# Altium schematic sheet Schematic.SchDoc (part 2 of 3)
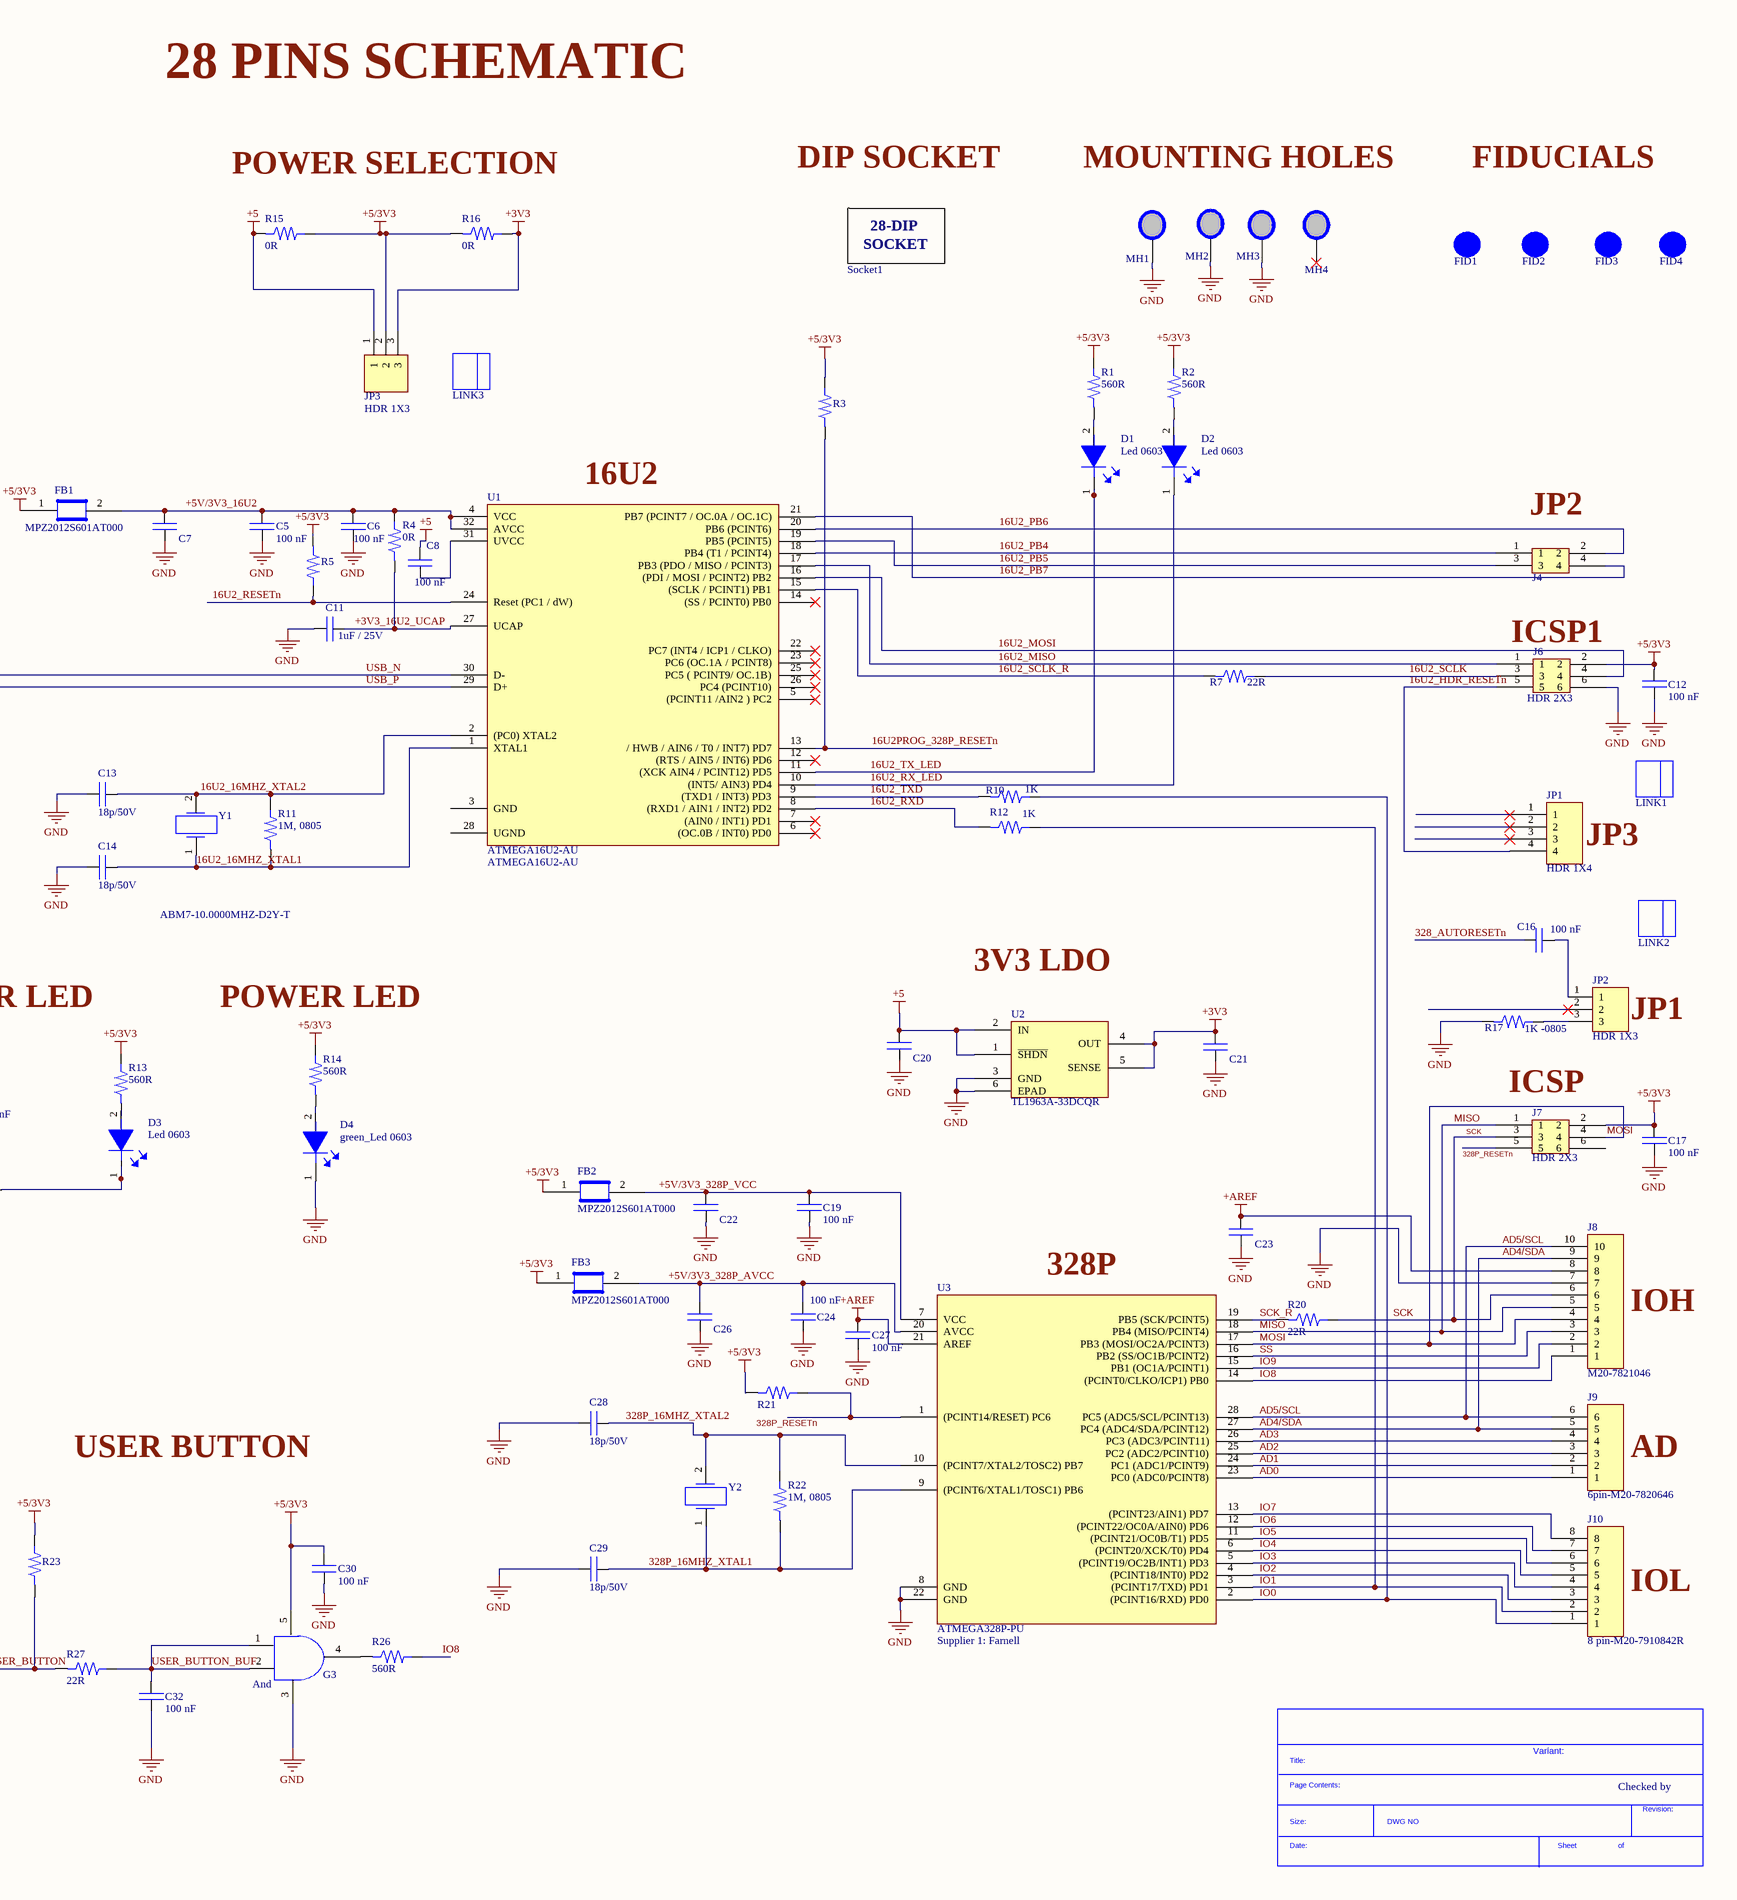
[diagram p2: Schematic.SchDoc, right]
## Library data of the parts
C1-C6 C8 C12 C15-C19 C24 C25 C27 C30-C33 = C2012X7R1H104K125AE: Cap Ceramic 0.1uF 50V X7R 10% SMD 0805 125°C Blister Plastic T/R; Manufacturer: TDK; Capacitance: 100nF; Supplier 1: Arrow Electronics; Supplier Part Number 1: C2012X7R1H104K125AE; Manufacturer Part Number: C2012X7R1H104K125AE; RoHS: Yes; Category: Ceramic Capacitors; Stock 1: 1940; Pricing 1: 1=0,23420, 10=0,11270, 25=0,11160, 50=0,10890, 100=0,09210, 250=0,09120, 500=0,06310, 1000=0,05490 (USD); Mount: Surface Mount; Case/Package: 0805; Case Code (Metric): 2012; Case Code (Imperial): 0805; Weight: 0.000194oz; Min Operating Temperature: -55°C; Max Operating Temperature: 125°C; Package Quantity: 2000; Packaging: Tape and Reel; Tolerance: 10%; Voltage Rating: 50V; Dielectric: X7R; Termination: SMD/SMT; Voltage Rating (DC): 50V; Features: Soft Termination; Length: 0.079inch; Width: 0.049inch; Height: 1.25mm; Thickness: 0.057inch; RoHS Compliant: Yes; ComponentLink1URL: https://datasheet.ciiva.com/29534/mlcc-commercial-soft-en-29534235.pdf?src-supplier=Digi-Key; ComponentLink1Description: https://datasheet.ciiva.com/29534/mlcc-commercial-soft-en-29534235.pdf?src-supplier=Digi-Key
C7 C20-C23 C26 = C2012X5R1C106M085AC: TDK - C2012X5R1C106M085AC - SMD Multilayer Ceramic Capacitor, 10 µF, 16 V, 0805 [2012 Metric], ± 20%, X5R, C Series TDK; Capacitance: 10uF; Supplier 1: Farnell; Supplier Part Number 1: 2522051; Manufacturer: TDK; Manufacturer Part Number: C2012X5R1C106M085AC; RoHS: Yes; Category: Ceramic Capacitors; Stock 1: 28000; Pricing 1: 4000=0,03440, 20000=0,03390, 40000=0,03330 (EUR); Mount: Surface Mount; Case/Package: 0805; Number of Pins: 2; Case Code (Metric): 2012; Case Code (Imperial): 0805; Weight: 0.000194oz; Dielectric Material: Ceramic; Min Operating Temperature: -55°C; Max Operating Temperature: 85°C; Packaging: Tape and Reel; Voltage Rating: 16V; Tolerance: 20%; Termination: SMD/SMT; Package Quantity: 4000; Voltage Rating (DC): 16V; Dielectric: X5R; Resistor Type: Ceramic; Series: C; Construction: Flat; Voltage: 16V; Length: 2mm; Width: 1.25mm; Height: 0.85mm; Thickness: 0.037inch; Depth: 1.25mm; RoHS Compliant: Yes; Lead Free: Lead Free; ComponentLink1URL: https://datasheet.ciiva.com/24218/c2012x5r1c106m085ac-265002-24218340.pdf?src-supplier=Mouser; ComponentLink1Description: https://datasheet.ciiva.com/24218/c2012x5r1c106m085ac-265002-24218340.pdf?src-supplier=Mouser; ComponentLink2URL: https://datasheet.ciiva.com/11788/0900766b80c1bb00-11788108.pdf?src-supplier=RSComponents; ComponentLink2Description: https://datasheet.ciiva.com/11788/0900766b80c1bb00-11788108.pdf?src-supplier=RSComponents; ComponentLink3URL: https://datasheet.ciiva.com/6290/tdkmlcccaprange-6290485.pdf?src-supplier=Digi-Key; ComponentLink3Description: https://datasheet.ciiva.com/6290/tdkmlcccaprange-6290485.pdf?src-supplier=Digi-Key; ComponentLink4URL: https://datasheet.ciiva.com/22725/1913358-22725557.pdf?src-supplier=Element14; ComponentLink4Description: https://datasheet.ciiva.com/22725/1913358-22725557.pdf?src-supplier=Element14; ComponentLink5URL: https://datasheet.ciiva.com/6290/tdkmlcccaprange-6290487.pdf?src-supplier=Digi-Key; ComponentLink5Description: https://datasheet.ciiva.com/6290/tdkmlcccaprange-6290487.pdf?src-supplier=Digi-Key; ComponentLink6URL: https://datasheet.ciiva.com/16449/e412-c-16449591.pdf?src-supplier=Future+Electronics; ComponentLink6Description: https://datasheet.ciiva.com/16449/e412-c-16449591.pdf?src-supplier=Future+Electronics; ComponentLink7URL: https://datasheet.ciiva.com/23803/1796654-23803021.pdf?src-supplier=Newark; ComponentLink7Description: https://datasheet.ciiva.com/23803/1796654-23803021.pdf?src-supplier=Newark
C9 C10 = EEE-1AA101WR: CAP ALUM 100UF 20% 10V SMD; Manufacturer: Panasonic; Ripple Current: 50mA; Life (Hours): 1000Hour; Supplier 1: Rs; Supplier Part Number 1: 1763738; Manufacturer Part Number: EEE-1AA101WR; RoHS: Yes; Category: Aluminum Electrolytic Capacitors; Stock 1: 1; Mount: Surface Mount,PCB; Case/Package: Radial; Contact Plating: Tin; Min Operating Temperature: -40°C; Max Operating Temperature: 85°C; Capacitance: 100uF; Voltage Rating: 10V; Tolerance: 20%; Packaging: Tape and Reel; Package Quantity: 1000; Voltage Rating (DC): 10V; Termination: SMD/SMT; Ripple Current (AC): 50mA; Series: S; Construction: Cylindrical; Diameter: 5mm; Length: 5.5mm; Height: 5.4mm; Height - Seated (Max): 0.213inch; Ratings: AEC-Q200; Radiation Hardening: No; Lead Free: Lead Free; RoHS Compliant: Yes; ComponentLink1URL: https://datasheet.ciiva.com/26945/getdatasheetpartid-169213-26945071.pdf?src-supplier=Verical; ComponentLink1Description: https://datasheet.ciiva.com/26945/getdatasheetpartid-169213-26945071.pdf?src-supplier=Verical; ComponentLink2URL: https://datasheet.ciiva.com/24027/aba0000ce2-40801-24027541.pdf?src-supplier=Mouser; ComponentLink2Description: https://datasheet.ciiva.com/24027/aba0000ce2-40801-24027541.pdf?src-supplier=Mouser; ComponentLink3URL: https://datasheet.ciiva.com/14598/70255710-14598233.pdf?src-supplier=Allied+Electronics; ComponentLink3Description: https://datasheet.ciiva.com/14598/70255710-14598233.pdf?src-supplier=Allied+Electronics; ComponentLink4URL: https://datasheet.ciiva.com/14605/70255710-14605689.pdf?src-supplier=Allied+Electronics; ComponentLink4Description: https://datasheet.ciiva.com/14605/70255710-14605689.pdf?src-supplier=Allied+Electronics; ComponentLink5URL: https://datasheet.ciiva.com/11673/aba0000ce2-11673882.pdf?src-supplier=Avnet; ComponentLink5Description: https://datasheet.ciiva.com/11673/aba0000ce2-11673882.pdf?src-supplier=Avnet; ComponentLink6URL: https://datasheet.ciiva.com/16427/aba0000ce2-16427544.pdf?src-supplier=Future+Electronics; ComponentLink6Description: https://datasheet.ciiva.com/16427/aba0000ce2-16427544.pdf?src-supplier=Future+Electronics; ComponentLink7URL: https://datasheet.ciiva.com/2983/aba0000ce2-2983906.pdf?src-supplier=Avnet; ComponentLink7Description: https://datasheet.ciiva.com/2983/aba0000ce2-2983906.pdf?src-supplier=Avnet; ComponentLink8URL: https://datasheet.ciiva.com/30075/11aba0000ce2-30075303.pdf?src-supplier=Onlinecomponents.com; ComponentLink8Description: https://datasheet.ciiva.com/30075/11aba0000ce2-30075303.pdf?src-supplier=Onlinecomponents.com
C11 = C2012X5R1E105K125AA: CAP CER 1UF 25V X5R 0805; Manufacturer: TDK; Dielectric Material: Ceramic; Tolerance: 10%; Supplier 1: Farnell; Supplier Part Number 1: 2525136; Manufacturer Part Number: C2012X5R1E105K125AA; RoHS: Yes; Category: Ceramic Capacitors; Stock 1: 864; Pricing 1: 5=0,09500, 50=0,08100, 250=0,06800, 500=0,05500, 1000=0,04900 (EUR); Mount: Surface Mount; Case/Package: 0805; Number of Pins: 2; Case Code (Metric): 2012; Case Code (Imperial): 0805; Weight: 0.000194oz; Min Operating Temperature: -55°C; Max Operating Temperature: 85°C; Capacitance: 1uF; Voltage Rating: 25V; Packaging: Tape and Reel; Voltage Rating (DC): 25V; Dielectric: X5R; Termination: SMD/SMT; Construction: Flat; Package Quantity: 2000; Resistor Type: Ceramic; Voltage: 25V; Series: C; Length: 2mm; Width: 0.049inch; Height: 1.25mm; Depth: 1.25mm; Thickness: 0.057inch; Radiation Hardening: No; Lead Free: Lead Free; RoHS Compliant: Yes; Reach SVHC Compliant: Yes; ComponentLink1URL: https://datasheet.ciiva.com/11787/0900766b80c1bb00-11787608.pdf?src-supplier=Rs; ComponentLink1Description: https://datasheet.ciiva.com/11787/0900766b80c1bb00-11787608.pdf?src-supplier=Rs; ComponentLink2URL: https://datasheet.ciiva.com/16449/e412-c-16449595.pdf?src-supplier=Future+Electronics; ComponentLink2Description: https://datasheet.ciiva.com/16449/e412-c-16449595.pdf?src-supplier=Future+Electronics; ComponentLink3URL: https://datasheet.ciiva.com/28602/1744655-28602171.pdf?src-supplier=Element14; ComponentLink3Description: https://datasheet.ciiva.com/28602/1744655-28602171.pdf?src-supplier=Element14; ComponentLink4URL: https://datasheet.ciiva.com/15192/getdatasheetpartid-726707-15192140.pdf?src-supplier=Verical; ComponentLink4Description: https://datasheet.ciiva.com/15192/getdatasheetpartid-726707-15192140.pdf?src-supplier=Verical
C13 C14 C28 C29 = C0805C180G5GAC7800: Cap Ceramic 18pF 50V C0G 2% SMD 0805 125°C Paper T/R; Manufacturer: KEMET; Supplier 1: Digi-Key; Supplier Part Number 1: 399-17433-1-ND; Manufacturer Part Number: C0805C180G5GAC7800; RoHS: Yes; Category: Ceramic Capacitors; Stock 1: 2700; Pricing 1: 1=0,51000, 10=0,36200, 50=0,27400, 100=0,23860, 500=0,17676, 1000=0,15024 (USD); Case/Package: 0805; Dielectric Material: Ceramic; Min Operating Temperature: -55°C; Max Operating Temperature: 125°C; Capacitance: 18pF; Tolerance: 2%; Packaging: Tape and Reel; Dielectric: C0G; Voltage Rating (DC): 50V; Length: 2mm; Depth: 1.25mm; Lead Free: Lead Free; RoHS Compliant: Yes
D1-D3 = LY L296-Q2R2-26-Z: LED Uni-Color Yellow 591nm 2-Pin Chip 0603(1608Metric) T/R; Manufacturer: Osram Opto; Lens Color: White; Luminous Intensity: 180mcd; Forward Current: 30mA; Viewing Angle: 160°; Forward Voltage: 2V; Lens Style: Flat,Rectangular,Diffused,Colorless; Test Current: 20mA; Dominant Wavelength: 587nm; Luminous Flux: 0.5lm; Number of Elements: 1; Power Dissipation: 80mW; Reverse Voltage: 12V; Lens Transparency: Diffused; Lens Size: 0.8mm; Supplier 1: Arrow Electronics; Supplier Part Number 1: LY L296-Q2R2-26-Z; Manufacturer Part Number: LY L296-Q2R2-26-Z; RoHS: Yes; Category: LEDs; Stock 1: 4966; Pricing 1: 1=0,40180, 10=0,24700, 25=0,24210, 100=0,14180, 250=0,13540, 500=0,12360, 1000=0,10280, 3000=0,09810 (USD); Mount: Surface Mount; Case/Package: 0603; Number of Pins: 2; Color: Yellow; Case Code (Imperial): 0603; Case Code (Metric): 1608; Min Operating Temperature: -40°C; Max Operating Temperature: 100°C; Packaging: Tape and Reel; Number of LEDs: 1; Illumination Color: Yellow; Package Quantity: 5000; Series: SMARTLED® 0603; Wavelength: 591nm; Length: 1.7mm; Width: 0.8mm; Depth: 0.8mm; Radiation Hardening: No; Reach SVHC Compliant: Yes; ComponentLink1URL: https://datasheet.ciiva.com/8060/30055-8060144.pdf?src-supplier=Element14; ComponentLink1Description: https://datasheet.ciiva.com/8060/30055-8060144.pdf?src-supplier=Element14
D4 = LY L296-Q2R2-26-Z_1: LED Uni-Color Yellow 591nm 2-Pin Chip 0603(1608Metric) T/R; Manufacturer: Osram Opto; Lens Color: White; Luminous Intensity: 180mcd; Forward Current: 30mA; Viewing Angle: 160°; Forward Voltage: 2V; Lens Style: Flat,Rectangular,Diffused,Colorless; Test Current: 20mA; Dominant Wavelength: 587nm; Luminous Flux: 0.5lm; Number of Elements: 1; Power Dissipation: 80mW; Reverse Voltage: 12V; Lens Transparency: Diffused; Lens Size: 0.8mm; Supplier 1: Arrow Electronics; Supplier Part Number 1: LY L296-Q2R2-26-Z; Manufacturer Part Number: LY L296-Q2R2-26-Z; RoHS: Yes; Category: LEDs; Stock 1: 4966; Pricing 1: 1=0,40180, 10=0,24700, 25=0,24210, 100=0,14180, 250=0,13540, 500=0,12360, 1000=0,10280, 3000=0,09810 (USD); Mount: Surface Mount; Case/Package: 0603; Number of Pins: 2; Color: Yellow; Case Code (Imperial): 0603; Case Code (Metric): 1608; Min Operating Temperature: -40°C; Max Operating Temperature: 100°C; Packaging: Tape and Reel; Number of LEDs: 1; Illumination Color: Yellow; Package Quantity: 5000; Series: SMARTLED® 0603; Wavelength: 591nm; Length: 1.7mm; Width: 0.8mm; Depth: 0.8mm; Radiation Hardening: No; Reach SVHC Compliant: Yes; ComponentLink1URL: https://datasheet.ciiva.com/8060/30055-8060144.pdf?src-supplier=Element14; ComponentLink1Description: https://datasheet.ciiva.com/8060/30055-8060144.pdf?src-supplier=Element14
D5 D6 = Schottky-BAT54HT1G: VR=30V IF=200mA 10pF P=200mW; Manufacturer: ON Semiconductor / Fairchild; Forward Voltage: 800mV; Forward Current: 200mA; Recovery Time: 5ns; Max Repetitive Reverse Voltage (Vrrm): 30V; Peak Non-Repetitive Surge Current: 600mA; Element Configuration: Single; Max Reverse Current: 2uA; Power Dissipation: 200mW; Polarity: Standard; Supplier 1: Farnell; Supplier Part Number 1: 1459033; Manufacturer Part Number: BAT54HT1G; RoHS: Yes; Category: Schottky Diodes; Stock 1: 99653; Pricing 1: 5=0,26400, 10=0,21900, 100=0,11700, 500=0,07700 (EUR); Mount: Surface Mount; Number of Pins: 2; Contact Plating: Tin,Matte; Min Operating Temperature: -55°C; Max Operating Temperature: 150°C; Packaging: Tape and Reel; Package Quantity: 1; Average Rectified Current: 200mA; Reverse Recovery Time: 5ns; Max Forward Surge Current (Ifsm): 600mA; Max Reverse Voltage (DC): 30V; Series: -; Max Surge Current: 600mA; Voltage Rating (DC): 30V; Current Rating: 200mA; Capacitance: 10pF; Output Current: 200mA; Reverse Voltage: 30V; Max Reverse Leakage Current: 2uA; Reverse Recovery Time-Max: 5ns; Length: 1.8mm; Width: 1.35mm; Height: 1mm; Radiation Hardening: No; Lead Free: Lead Free; RoHS Compliant: Yes; Reach SVHC Compliant: Yes; ComponentLink1URL: https://datasheet.ciiva.com/4714/bat54ht1-d-72881-4714706.pdf?src-supplier=Mouser; ComponentLink1Description: https://datasheet.ciiva.com/4714/bat54ht1-d-72881-4714706.pdf?src-supplier=Mouser; ComponentLink2URL: https://datasheet.ciiva.com/4452/bat54ht1g-104602-4452889.pdf?src-supplier=Mouser; ComponentLink2Description: https://datasheet.ciiva.com/4452/bat54ht1g-104602-4452889.pdf?src-supplier=Mouser; ComponentLink3URL: https://datasheet.ciiva.com/30479/0900766b811a63a9-30479442.pdf?src-supplier=RSComponents; ComponentLink3Description: https://datasheet.ciiva.com/30479/0900766b811a63a9-30479442.pdf?src-supplier=RSComponents; ComponentLink4URL: https://datasheet.ciiva.com/34301/806549-34301562.pdf?src-supplier=Jameco; ComponentLink4Description: https://datasheet.ciiva.com/34301/806549-34301562.pdf?src-supplier=Jameco; ComponentLink5URL: https://datasheet.ciiva.com/1240/1747983-1240762.pdf?src-supplier=Newark; ComponentLink5Description: https://datasheet.ciiva.com/1240/1747983-1240762.pdf?src-supplier=Newark; ComponentLink6URL: https://datasheet.ciiva.com/915/bat54ht1-d-915445.pdf?src-supplier=Digi-Key; ComponentLink6Description: https://datasheet.ciiva.com/915/bat54ht1-d-915445.pdf?src-supplier=Digi-Key; ComponentLink7URL: https://datasheet.ciiva.com/915/bat54ht1-d-915444.pdf?src-supplier=Digi-Key; ComponentLink7Description: https://datasheet.ciiva.com/915/bat54ht1-d-915444.pdf?src-supplier=Digi-Key; ComponentLink8URL: https://datasheet.ciiva.com/910/bat54ht1g-910499.pdf?src-supplier=Digi-Key; ComponentLink8Description: https://datasheet.ciiva.com/910/bat54ht1g-910499.pdf?src-supplier=Digi-Key; ComponentLink9URL: https://datasheet.ciiva.com/910/bat54ht1g-910498.pdf?src-supplier=Digi-Key; ComponentLink9Description: https://datasheet.ciiva.com/910/bat54ht1g-910498.pdf?src-supplier=Digi-Key; ComponentLink10URL: https://datasheet.ciiva.com/8294/bat54ht1-d-8294645.pdf?src-supplier=Avnet; ComponentLink10Description: https://datasheet.ciiva.com/8294/bat54ht1-d-8294645.pdf?src-supplier=Avnet; ComponentLink11URL: https://datasheet.ciiva.com/910/bat54ht1g-910497.pdf?src-supplier=Digi-Key; ComponentLink11Description: https://datasheet.ciiva.com/910/bat54ht1g-910497.pdf?src-supplier=Digi-Key; ComponentLink12URL: https://datasheet.ciiva.com/8303/bat54ht1g-8303645.pdf?src-supplier=Avnet; ComponentLink12Description: https://datasheet.ciiva.com/8303/bat54ht1g-8303645.pdf?src-supplier=Avnet; ComponentLink13URL: https://datasheet.ciiva.com/915/bat54ht1-d-915443.pdf?src-supplier=Digi-Key; ComponentLink13Description: https://datasheet.ciiva.com/915/bat54ht1-d-915443.pdf?src-supplier=Digi-Key; ComponentLink14URL: https://datasheet.ciiva.com/46429/1727620-46429206.pdf?src-supplier=Element14; ComponentLink14Description: https://datasheet.ciiva.com/46429/1727620-46429206.pdf?src-supplier=Element14; ComponentLink15URL: https://datasheet.ciiva.com/1180/bat54ht1-d-1180252.pdf?src-supplier=Element14; ComponentLink15Description: https://datasheet.ciiva.com/1180/bat54ht1-d-1180252.pdf?src-supplier=Element14; ComponentLink16URL: https://datasheet.ciiva.com/1180/bat54ht1-d-1180251.pdf?src-supplier=Element14; ComponentLink16Description: https://datasheet.ciiva.com/1180/bat54ht1-d-1180251.pdf?src-supplier=Element14; ComponentLink17URL: https://datasheet.ciiva.com/17020/bat54ht1g-17020445.pdf?src-supplier=Future+Electronics; ComponentLink17Description: https://datasheet.ciiva.com/17020/bat54ht1g-17020445.pdf?src-supplier=Future+Electronics; ComponentLink18URL: https://datasheet.ciiva.com/48686/001262925-da-01-en-diode-schottky-30v-bat54ht1g-sod-323-fsc-48686266.pdf?src-supplier=Conrad; ComponentLink18Description: https://datasheet.ciiva.com/48686/001262925-da-01-en-diode-schottky-30v-bat54ht1g-sod-323-fsc-48686266.pdf?src-supplier=Conrad
FB1-FB3 = MPZ2012S601AT000: 0805 600Ω ±25% DCR=0.1Ω 2A; Manufacturer: TDK; Impedance: 600R; DC Resistance (DCR): 100mR; Number of Lines: 1; Manufacturer Part Number: MPZ2012S601AT000; RoHS: Yes; Category: Ferrite Beads and Chips; Stock 1: 18550; Pricing 1: 1=0,14000, 25=0,09740, 50=0,07960, 100=0,05010, 250=0,04620, 500=0,04230 (EUR); Mount: Surface Mount; Case/Package: 0805; Case Code (Metric): 2012; Case Code (Imperial): 0805; Min Operating Temperature: -55°C; Max Operating Temperature: 125°C; Packaging: Tape and Reel; Package Quantity: 1; Current Rating: 2A; Max DC Current: 2A; Series: MPZ; Max Current Rating: 2A; Length: 0.079inch; Width: 0.049inch; Height: 0.041inch; Reach SVHC Compliant: Yes; Lead Free: Lead Free; RoHS Compliant: Yes; ComponentLink1URL: https://datasheet.ciiva.com/46634/beads-commercial-power-mpz-en-46634335.pdf?src-supplier=Digi-Key; ComponentLink1Description: https://datasheet.ciiva.com/46634/beads-commercial-power-mpz-en-46634335.pdf?src-supplier=Digi-Key; ComponentLink2URL: https://datasheet.ciiva.com/46634/beads-commercial-power-mpz-en-46634377.pdf?src-supplier=Digi-Key; ComponentLink2Description: https://datasheet.ciiva.com/46634/beads-commercial-power-mpz-en-46634377.pdf?src-supplier=Digi-Key; ComponentLink3URL: https://datasheet.ciiva.com/46634/beads-commercial-power-mpz-en-46634606.pdf?src-supplier=Digi-Key; ComponentLink3Description: https://datasheet.ciiva.com/46634/beads-commercial-power-mpz-en-46634606.pdf?src-supplier=Digi-Key; Supplier 1: Farnell; Supplier Part Number 1: 2393201
FID1-FID4 = Fiducial
G1-G4 = ANDGATE-SN74AHC1G09DBVR: Single 2-input, 2-V to 5.5-V AND gate with open-drain outputs 5-SOT-23 -55 to 125; Manufacturer: Texas Instruments; Min Supply Voltage: 2V; Max Supply Voltage: 5.5V; Quiescent Current: 1uA; Number of Inputs: 2; Propagation Delay: 7.5ns; Output Current: 25mA; Number of Circuits: 1; Low Level Output Current: 8mA; Supplier 1: Arrow Electronics; Supplier Part Number 1: SN74AHC1G09DBVR; Manufacturer Part Number: SN74AHC1G09DBVR; RoHS: Yes; Category: Logic Gates; Stock 1: 2650; Pricing 1: 1=0,40600, 10=0,30350, 25=0,29040, 100=0,20490, 250=0,18350, 500=0,15590, 1000=0,12700 (USD); Mount: Surface Mount; Case/Package: SOT-23; Number of Pins: 5; Contact Plating: Tin,Matte; Min Operating Temperature: -55°C; Max Operating Temperature: 125°C; Logic Function: AND GATE; Package Quantity: 3000; Packaging: Tape and Reel; Number of Gates: 1; Number of Elements: 1; Number of Bits: 1; Series: 74AHC; Technology: CMOS; Output Voltage: 5.5V; Number of Outputs: 1; Radiation Hardening: No; Reach SVHC Compliant: Yes; Lead Free: Lead Free; RoHS Compliant: Yes; ComponentLink1URL: https://datasheet.ciiva.com/1864/sn74ahc1g09-1864411.pdf?src-supplier=Digi-Key; ComponentLink1Description: https://datasheet.ciiva.com/1864/sn74ahc1g09-1864411.pdf?src-supplier=Digi-Key; ComponentLink2URL: https://datasheet.ciiva.com/1864/sn74ahc1g09-1864410.pdf?src-supplier=Digi-Key; ComponentLink2Description: https://datasheet.ciiva.com/1864/sn74ahc1g09-1864410.pdf?src-supplier=Digi-Key; ComponentLink3URL: https://datasheet.ciiva.com/1864/sn74ahc1g09-1864412.pdf?src-supplier=Digi-Key; ComponentLink3Description: https://datasheet.ciiva.com/1864/sn74ahc1g09-1864412.pdf?src-supplier=Digi-Key
J1 J2 = PAD_WITH_HOLE_4MMx1.5MM: Pad with a hole 4mm x 1.5mm
J3 J10 = 8 pin-M20-7910842R: Connector, Rcpt, 8POS, 2.54MM, 1ROW; Manufacturer: Harwin; Connector Type: Receptacle,Forked; Number of Positions: 8; Current Rating: 3A; Supplier 1: Farnell; Supplier Part Number 1: 3226218; Manufacturer Part Number: M20-7910842R; RoHS: Yes; Category: Connectors; Stock 1: 1170; Pricing 1: 1=0,69700, 32=0,68400, 97=0,66900, 260=0,65600, 650=0,64200 (EUR); Mount: Surface Mount; Contact Plating: Gold; Contact Material: Bronze; Insulation Color: Black; Insulation Material: Nylon; Contact Shape: Square; Min Operating Temperature: -40°C; Max Operating Temperature: 105°C; Fastening Type: Push,Pull; Packaging: Tape and Reel; Number of Rows: 1; Termination: Solder; Flammability Rating: UL94 V-0; RoHS Compliant: Yes; ComponentLink1URL: https://cdn.harwin.com/pdfs/M20-791R.pdf?src-supplier=Digi-Key; ComponentLink1Description: https://cdn.harwin.com/pdfs/M20-791R.pdf?src-supplier=Digi-Key
J4 = 2x2Header-67997-204HLF: Conn Unshrouded Header HDR 4 POS 2.54mm Solder ST Top Entry Thru-Hole BergStik® Bulk; Manufacturer: Amphenol ICC / FCI; Number of Contacts: 4; Current Rating: 3A; Voltage Rating: 1.5kV; Insulation Resistance: 5GR; Gender: Male; Connector Type: Male Pin; Row Spacing: 0.1inch; Contact Post Length: 3.05mm; Supplier 1: Mouser; Supplier Part Number 1: 649-67997-204HLF; Manufacturer Part Number: 67997-204HLF; RoHS: Yes; Category: Headers and Wire Housings; Stock 1: 2326; Pricing 1: 1=0,42000, 10=0,36000, 50=0,36000, 100=0,28100, 1000=0,18300, 10000=0,16200 (USD); Mount: Through Hole; Contact Plating: Gold,GXT; Contact Material: Bronze; Color: Black; Housing Color: Black; Housing Material: Thermoplastic; Min Operating Temperature: -65°C; Max Operating Temperature: 125°C; Number of Rows: 2; Termination: Solder; Package Quantity: 100; Packaging: Bulk; Contact Gender: Male; Number of Positions: 4; Max Voltage Rating (AC): 1.5kV; Orientation: Straight; Series: 67997; Contact Type: Male Pin; Length: 5.08mm; Pitch: 2.54mm; Contact Mating Length: 0.23inch; Depth: 4.83mm; Radiation Hardening: No; Reach SVHC Compliant: Yes; Flammability Rating: UL94 V-0; RoHS Compliant: Yes; ComponentLink1URL: https://datasheet.ciiva.com/5154/67996-223472-5154939.pdf?src-supplier=Mouser; ComponentLink1Description: https://datasheet.ciiva.com/5154/67996-223472-5154939.pdf?src-supplier=Mouser; ComponentLink2URL: https://datasheet.ciiva.com/10149/67996-10149756.pdf?src-supplier=Avnet; ComponentLink2Description: https://datasheet.ciiva.com/10149/67996-10149756.pdf?src-supplier=Avnet; ComponentLink3URL: https://datasheet.ciiva.com/46395/1748781-46395957.pdf?src-supplier=Element14; ComponentLink3Description: https://datasheet.ciiva.com/46395/1748781-46395957.pdf?src-supplier=Element14; ComponentLink4URL: https://datasheet.ciiva.com/728/67996-728874.pdf?src-supplier=Digi-Key; ComponentLink4Description: https://datasheet.ciiva.com/728/67996-728874.pdf?src-supplier=Digi-Key
J5 = 10118193-0001LF: FCI Right Angle Surface Mount Mount Female USB Connector; 100 V ac; 1.8A; Manufacturer: Amphenol ICC / FCI; Supplier 1: Rs; Supplier Part Number 1: 8632989; Manufacturer Part Number: 10118193-0001LF; RoHS: No; Category: USB Connectors; Stock 1: 2500; ComponentLink1URL: http://uk.rs-online.com/webdocs/1450/0900766b814507f1.pdf?src-supplier=Rs; ComponentLink1Description: http://uk.rs-online.com/webdocs/1450/0900766b814507f1.pdf?src-supplier=Rs; ComponentLink2URL: http://www.amphenol-icc.com/media/wysiwyg/files/drawing/10118193.pdf?src-supplier=Digi-Key; ComponentLink2Description: http://www.amphenol-icc.com/media/wysiwyg/files/drawing/10118193.pdf?src-supplier=Digi-Key; ComponentLink3URL: https://cdn.amphenol-icc.com/media/wysiwyg/files/documentation/datasheet/inputoutput/io_usb_micro.pdf?src-supplier=Digi-Key; ComponentLink3Description: https://cdn.amphenol-icc.com/media/wysiwyg/files/documentation/datasheet/inputoutput/io_usb_micro.pdf?src-supplier=Digi-Key; ComponentLink4URL: https://cdn.amphenol-icc.com/media/wysiwyg/files/documentation/datasheet/inputoutput/io_usb_micro.pdf?src-supplier=Onlinecomponents.com; ComponentLink4Description: https://cdn.amphenol-icc.com/media/wysiwyg/files/documentation/datasheet/inputoutput/io_usb_micro.pdf?src-supplier=Onlinecomponents.com; ComponentLink5URL: https://cdn.amphenol-icc.com/media/wysiwyg/files/documentation/datasheet/inputoutput/io_usb_micro.pdf?src-supplier=Verical; ComponentLink5Description: https://cdn.amphenol-icc.com/media/wysiwyg/files/documentation/datasheet/inputoutput/io_usb_micro.pdf?src-supplier=Verical; ComponentLink6URL: https://cdn.amphenol-icc.com/media/wysiwyg/files/documentation/datasheet/inputoutput/io_usb_micro.pdf?src-supplier=Allied+Electronics; ComponentLink6Description: https://cdn.amphenol-icc.com/media/wysiwyg/files/documentation/datasheet/inputoutput/io_usb_micro.pdf?src-supplier=Allied+Electronics; ComponentLink7URL: https://cdn.amphenol-icc.com/media/wysiwyg/files/documentation/datasheet/inputoutput/io_usb_micro.pdf?src-supplier=Mouser; ComponentLink7Description: https://cdn.amphenol-icc.com/media/wysiwyg/files/documentation/datasheet/inputoutput/io_usb_micro.pdf?src-supplier=Mouser; ComponentLink8URL: https://cdn.amphenol-icc.com/media/wysiwyg/files/documentation/datasheet/inputoutput/io_usb_micro.pdf?src-supplier=Avnet; ComponentLink8Description: https://cdn.amphenol-icc.com/media/wysiwyg/files/documentation/datasheet/inputoutput/io_usb_micro.pdf?src-supplier=Avnet; ComponentLink9URL: https://cdn.amphenol-icc.com/media/wysiwyg/files/documentation/datasheet/inputoutput/io_usb_micro.pdf?src-supplier=Arrow+Electronics; ComponentLink9Description: https://cdn.amphenol-icc.com/media/wysiwyg/files/documentation/datasheet/inputoutput/io_usb_micro.pdf?src-supplier=Arrow+Electronics; ComponentLink10URL: https://cdn.amphenol-icc.com/media/wysiwyg/files/documentation/datasheet/inputoutput/io_usb_micro.pdf?src-supplier=Rs; ComponentLink10Description: https://cdn.amphenol-icc.com/media/wysiwyg/files/documentation/datasheet/inputoutput/io_usb_micro.pdf?src-supplier=Rs; ComponentLink11URL: https://cdn.amphenol-icc.com/media/wysiwyg/files/documentation/datasheet/inputoutput/io_usb_micro.pdf?src-supplier=TTI; ComponentLink11Description: https://cdn.amphenol-icc.com/media/wysiwyg/files/documentation/datasheet/inputoutput/io_usb_micro.pdf?src-supplier=TTI; ComponentLink12URL: https://cdn.amphenol-icc.com/media/wysiwyg/files/documentation/datasheet/inputoutput/io_usb_micro.pdf?src-supplier=TME; ComponentLink12Description: https://cdn.amphenol-icc.com/media/wysiwyg/files/documentation/datasheet/inputoutput/io_usb_micro.pdf?src-supplier=TME; ComponentLink13URL: https://cdn.amphenol-icc.com/media/wysiwyg/files/documentation/datasheet/inputoutput/io_usb_micro.pdf?src-supplier=Heilind+Electronics; ComponentLink13Description: https://cdn.amphenol-icc.com/media/wysiwyg/files/documentation/datasheet/inputoutput/io_usb_micro.pdf?src-supplier=Heilind+Electronics
J6 J7 = ICSP HEADER 67997-106HLF: Conn Unshrouded Header HDR 6 POS 2.54mm Solder ST Top Entry Thru-Hole BergStik® Bulk; Manufacturer: Amphenol ICC / FCI; Supplier 1: Avnet; Supplier Part Number 1: 06M1758; Manufacturer Part Number: 67997-106HLF; RoHS: No; Category: Headers and Wire Housings; Stock 1: 6; Pricing 1: 1=1,53000 (USD); ComponentLink1URL: http://uk.rs-online.com/webdocs/1450/0900766b81450b8b.pdf?src-supplier=RSComponents; ComponentLink1Description: http://uk.rs-online.com/webdocs/1450/0900766b81450b8b.pdf?src-supplier=RSComponents; ComponentLink2URL: https://cdn.amphenol-icc.com/media/wysiwyg/files/drawing/67996.pdf?src-supplier=Onlinecomponents.com; ComponentLink2Description: https://cdn.amphenol-icc.com/media/wysiwyg/files/drawing/67996.pdf?src-supplier=Onlinecomponents.com; ComponentLink3URL: https://cdn.amphenol-icc.com/media/wysiwyg/files/drawing/67996.pdf?src-supplier=Digi-Key; ComponentLink3Description: https://cdn.amphenol-icc.com/media/wysiwyg/files/drawing/67996.pdf?src-supplier=Digi-Key; ComponentLink4URL: http://components.arrow.com/part/dataview/41913658S7633350N8314?src-supplier=Arrow+Electronics; ComponentLink4Description: http://components.arrow.com/part/dataview/41913658S7633350N8314?src-supplier=Arrow+Electronics; ComponentLink5URL: http://www.farnell.com/datasheets/1876884.pdf?src-supplier=Newark; ComponentLink5Description: http://www.farnell.com/datasheets/1876884.pdf?src-supplier=Newark; ComponentLink6URL: https://cdn.amphenol-icc.com/media/wysiwyg/files/drawing/67996.pdf?src-supplier=Allied+Electronics; ComponentLink6Description: https://cdn.amphenol-icc.com/media/wysiwyg/files/drawing/67996.pdf?src-supplier=Allied+Electronics; ComponentLink7URL: https://cdn.amphenol-icc.com/media/wysiwyg/files/drawing/67996.pdf?src-supplier=Mouser; ComponentLink7Description: https://cdn.amphenol-icc.com/media/wysiwyg/files/drawing/67996.pdf?src-supplier=Mouser; ComponentLink8URL: http://www.farnell.com/datasheets/1876884.pdf?src-supplier=Farnell; ComponentLink8Description: http://www.farnell.com/datasheets/1876884.pdf?src-supplier=Farnell; ComponentLink9URL: https://cdn.amphenol-icc.com/media/wysiwyg/files/drawing/67996.pdf?src-supplier=Avnet; ComponentLink9Description: https://cdn.amphenol-icc.com/media/wysiwyg/files/drawing/67996.pdf?src-supplier=Avnet; ComponentLink10URL: https://cdn.amphenol-icc.com/media/wysiwyg/files/drawing/67996.pdf?src-supplier=TTI; ComponentLink10Description: https://cdn.amphenol-icc.com/media/wysiwyg/files/drawing/67996.pdf?src-supplier=TTI; ComponentLink11URL: https://cdn.amphenol-icc.com/media/wysiwyg/files/drawing/67996.pdf?src-supplier=Heilind+Electronics; ComponentLink11Description: https://cdn.amphenol-icc.com/media/wysiwyg/files/drawing/67996.pdf?src-supplier=Heilind+Electronics
J8 = M20-7821046: 2.54mm (0.1") Pitch SIL Vertical PC Tail Socket Assembly, tin, 10 contacts; Manufacturer: Harwin; Number of Contacts: 10; Max Current Rating: 3A; Contact Resistance: 20mR; Mating Cycles: 50; Connector Type: Receptacle; Insulation Resistance: 1MR; Voltage Rating: 1kV; Hole Diameter: 0.8mm; Mated Stacking Heights: 12.63mm; Supplier 1: Farnell; Supplier Part Number 1: 7991959; Manufacturer Part Number: M20-7821046; RoHS: Yes; Category: Headers and Wire Housings; Stock 1: 1223; Pricing 1: 1=1,45000, 10=1,26000, 100=1,12000, 500=0,93600, 1000=0,80200, 2500=0,78600 (EUR); Mount: Through Hole; Case/Package: SIL; Color: Black; Contact Plating: Tin; Contact Material: Bronze; Housing Color: Black; Housing Material: Nylon; Contact Finish - Mating: TIN; Insulation Color: Black; Insulation Material: Nylon; Contact Shape: Square; Min Operating Temperature: -40°C; Max Operating Temperature: 105°C; Number of Rows: 1; Termination: Solder; Packaging: Rail/Tube; Contact Gender: Female; Package Quantity: 23; Current Rating: 3A; Number of Positions: 10; Gender: Receptacle; Orientation: Straight; Series: M20; Contact Type: Female Socket; Fastening Type: Pull; Length: 25.8mm; Pitch: 2.54mm; Lead Pitch: 2.54mm; Depth: 2.5mm; Radiation Hardening: No; Reach SVHC Compliant: Yes; RoHS Compliant: Yes; Flammability Rating: UL94 V-0; ComponentLink1URL: https://datasheet.ciiva.com/26899/getdatasheetpartid-559226-26899379.pdf?src-supplier=Verical; ComponentLink1Description: https://datasheet.ciiva.com/26899/getdatasheetpartid-559226-26899379.pdf?src-supplier=Verical; ComponentLink2URL: https://datasheet.ciiva.com/11753/0900766b80dc1d2b-11753869.pdf?src-supplier=RSComponents; ComponentLink2Description: https://datasheet.ciiva.com/11753/0900766b80dc1d2b-11753869.pdf?src-supplier=RSComponents; ComponentLink3URL: https://datasheet.ciiva.com/6785/m20-782-6785605.pdf?src-supplier=Digi-Key; ComponentLink3Description: https://datasheet.ciiva.com/6785/m20-782-6785605.pdf?src-supplier=Digi-Key; ComponentLink4URL: https://datasheet.ciiva.com/10151/m20-782-10151366.pdf?src-supplier=Avnet; ComponentLink4Description: https://datasheet.ciiva.com/10151/m20-782-10151366.pdf?src-supplier=Avnet
J9 = 6pin-M20-7820646: 2.54mm (0.1") Pitch SIL Vertical PC Tail Socket Assembly, tin, 6 contacts; Manufacturer: Harwin; Max Current Rating: 3A; Contact Resistance: 20mR; Connector Type: Receptacle; Number of Positions: 6; Gender: Female; Supplier 1: Digi-Key; Supplier Part Number 1: 952-1809-ND; Manufacturer Part Number: M20-7820646; RoHS: Yes; Category: Headers and Wire Housings; Stock 1: 1884; Pricing 1: 1=1,24000, 10=1,05200, 100=0,94440, 500=0,77264, 1000=0,68680, 5000=0,60095, 10000=0,57090 (USD); Mount: Through Hole; Case/Package: SIL; Color: Black; Contact Plating: Tin; Contact Material: Bronze; Housing Color: Black; Housing Material: Nylon; Min Operating Temperature: -40°C; Max Operating Temperature: 105°C; Packaging: Rail/Tube; Number of Rows: 1; Contact Gender: Female; Package Quantity: 38; Termination: Solder; Number of Contacts: 6; Orientation: Straight; Series: M20; Contact Type: Female Socket; Length: 15.64mm; Pitch: 2.54mm; Depth: 2.5mm; Radiation Hardening: No; RoHS Compliant: Yes; ComponentLink1URL: http://www.harwin.com/include/downloads/pdfs/2010PAGE120.PDF?src-supplier=Avnet; ComponentLink1Description: http://www.harwin.com/include/downloads/pdfs/2010PAGE120.PDF?src-supplier=Avnet; ComponentLink2URL: https://cdn.harwin.com/pdfs/M20-782.pdf?src-supplier=Digi-Key; ComponentLink2Description: https://cdn.harwin.com/pdfs/M20-782.pdf?src-supplier=Digi-Key; ComponentLink3URL: https://cdn.harwin.com/pdfs/Harwin_PC_Connectors_M20.pdf?src-supplier=RSComponents; ComponentLink3Description: https://cdn.harwin.com/pdfs/Harwin_PC_Connectors_M20.pdf?src-supplier=RSComponents; ComponentLink4URL: https://cdn.harwin.com/pdfs/Harwin_PC_Connectors_M20.pdf?src-supplier=Mouser; ComponentLink4Description: https://cdn.harwin.com/pdfs/Harwin_PC_Connectors_M20.pdf?src-supplier=Mouser; ComponentLink5URL: https://cdn.harwin.com/pdfs/Harwin_PC_Connectors_M20.pdf?src-supplier=TTI; ComponentLink5Description: https://cdn.harwin.com/pdfs/Harwin_PC_Connectors_M20.pdf?src-supplier=TTI
JP1 = 4X1_68001-204HLF: Conn Unshrouded Header HDR 4 POS 2.54mm Solder ST Thru-Hole Bag; Manufacturer: Amphenol ICC; Supplier 1: Allied Electronics; Supplier Part Number 1: 70302499; Manufacturer Part Number: 68001-204HLF; RoHS: Yes; Category: Uncategorized; ComponentLink1URL: http://www.farnell.com/cad/2615197.pdf?src-supplier=Farnell; ComponentLink1Description: http://www.farnell.com/cad/2615197.pdf?src-supplier=Farnell; ComponentLink2URL: http://www.farnell.com/cad/2615197.pdf?src-supplier=Newark; ComponentLink2Description: http://www.farnell.com/cad/2615197.pdf?src-supplier=Newark
JP2 JP3 = 3pin-68000-103HLF: Conn Unshrouded Header HDR 3 POS 2.54mm Solder ST Top Entry Thru-Hole BergStik® Automotive Bulk; Manufacturer: Amphenol ICC / FCI; Supplier 1: Avnet; Supplier Part Number 1: 88K1775; Manufacturer Part Number: 68000-103HLF; RoHS: No; Category: Headers and Wire Housings; Stock 1: 5922; Pricing 1: 1=0,40100, 10=0,28000, 25=0,27600, 50=0,27400, 100=0,27000, 250=0,25200, 500=0,23400 (USD); ComponentLink1URL: https://datasheet.ciiva.com/46392/1914865-46392021.pdf?src-supplier=Element14; ComponentLink1Description: https://datasheet.ciiva.com/46392/1914865-46392021.pdf?src-supplier=Element14
L1 = L1210R2R2MDWIT: Inductor RF Chip Wirewound 2.2uH 20% 100KHz 1.13A 0.104Ohm DCR 1210 T/R; Manufacturer: KEMET; Core Material: Ferrite; Max DC Current: 2A; Shielding: Unshielded; Self Resonant Frequency: 190MHz; DC Resistance (DCR): 80mR; Supplier 1: Farnell; Supplier Part Number 1: 3638976; Manufacturer Part Number: L1210R2R2MDWIT; RoHS: Yes; Category: Fixed Inductors; Stock 1: 12; Pricing 1: 1=0,33100, 50=0,30700, 100=0,28300, 250=0,26800, 500=0,25300, 1000=0,19200, 5000=0,18600 (EUR); Mount: Surface Mount; Case/Package: 1210; Case Code (Metric): 3225; Case Code (Imperial): 1210; Min Operating Temperature: -40°C; Max Operating Temperature: 105°C; Tolerance: 20%; Inductance: 2.2uH; Package Quantity: 1000; Current Rating: 2A; Packaging: Tape and Reel; Inductance Tolerance: 20%; Resistor Type: Wirewound,Ceramic; Test Frequency: 100kHz; Termination: SMD/SMT; DC Current: 1.13A; Series: L-DWI; Length: 3.2mm; Width: 2.5mm; Height: 2.5mm; Height - Seated (Max): 0.106inch; Depth: 2.7mm; Radiation Hardening: No; Reach SVHC Compliant: Yes; Military Standard: Not; RoHS Compliant: Yes; ComponentLink1URL: https://datasheet.ciiva.com/4957/f3115-4957838.pdf?src-supplier=Mouser; ComponentLink1Description: https://datasheet.ciiva.com/4957/f3115-4957838.pdf?src-supplier=Mouser; ComponentLink2URL: https://datasheet.ciiva.com/6691/f3115-6691487.pdf?src-supplier=Digi-Key; ComponentLink2Description: https://datasheet.ciiva.com/6691/f3115-6691487.pdf?src-supplier=Digi-Key; ComponentLink3URL: https://datasheet.ciiva.com/8512/f3115-8512543.pdf?src-supplier=Avnet; ComponentLink3Description: https://datasheet.ciiva.com/8512/f3115-8512543.pdf?src-supplier=Avnet; ComponentLink4URL: https://datasheet.ciiva.com/22685/27262-22685038.pdf?src-supplier=Element14; ComponentLink4Description: https://datasheet.ciiva.com/22685/27262-22685038.pdf?src-supplier=Element14
LINK1-LINK3 = QPC02SXGN-RC: 2 Position 2.54 mm Centerline Single Circuit Open Top Jumper; Manufacturer: Sullins; Supplier 1: Digi-Key; Supplier Part Number 1: S9337-ND; Manufacturer Part Number: QPC02SXGN-RC; RoHS: Yes; Category: Connectors; Stock 1: 604176; Pricing 1: 1=0,10000, 10=0,05000, 25=0,04080, 50=0,03780, 100=0,03650, 250=0,03152, 500=0,03024, 1000=0,02646, 2500=0,02394 (USD); ComponentLink1URL: https://datasheet.ciiva.com/767/284-sxgn-11510-767869.pdf?src-supplier=Digi-Key; ComponentLink1Description: https://datasheet.ciiva.com/767/284-sxgn-11510-767869.pdf?src-supplier=Digi-Key
MH4 = MH_7.4MMHC_3.2MMD_NoCopper
R1 R2 R13 R14 R26 = RC0805FR-07560RL: Res General Purpose Thick Film 0805 560 Ohm 1% 1/8W ±100ppm/°C Molded Paper T/R; Manufacturer: Yageo; Power Rating: 125mW; Voltage Rating: 150V; Supplier 1: Farnell; Supplier Part Number 1: 9237461; Manufacturer Part Number: RC0805FR-07560RL; RoHS: Yes; Category: Chip SMD Resistors; Stock 1: 10006; Pricing 1: 10=0,02900, 100=0,01200, 500=0,00900, 1000=0,00600, 2500=0,00500 (EUR); Case/Package: 0805; Case Code (Metric): 2012; Case Code (Imperial): 0805; Weight: 0.000194oz; Size Code: 0805; Min Operating Temperature: -55°C; Max Operating Temperature: 155°C; Tolerance: 1%; Resistance: 560R; Packaging: Cut Tape; Resistor Type: Thick Film; Temperature Coefficient: 100ppm/°C; Package Quantity: 1; Number of Terminations: 2; Termination: SMD/SMT; Max Power Dissipation: 125mW; Features: Moisture Resistant; Series: RC; Resistance Tolerance: 1%; Construction: Rectangular; Length: 0.079inch; Width: 0.049inch; Height: 0.024inch; Depth: 1.25mm; Lead Free: Lead Free; RoHS Compliant: Yes; Military Standard: Not
R3 = AC0805FR-07100KL: Res Thick Film 0805 100K Ohm 1% 1/8W ±100ppm/°C Molded SMD SMD Paper T/R; Manufacturer: Yageo; Resistance: 100kR; Power Rating: 125mW; Voltage Rating: 150V; Supplier 1: Rs; Supplier Part Number 1: 1978153; Manufacturer Part Number: AC0805FR-07100KL; RoHS: Yes; Category: Chip SMD Resistors; Stock 1: 1000; Pricing 1: 500=0,01600, 2500=0,01000 (GBP); Case/Package: 0805; Contact Plating: Tin,Matte; Case Code (Imperial): 0805; Case Code (Metric): 2012; Size Code: 0805; Min Operating Temperature: -55°C; Max Operating Temperature: 155°C; Tolerance: 1%; Resistor Type: Thick Film; Temperature Coefficient: 100ppm/°C; Packaging: Tape and Reel; Number of Terminations: 2; Termination: SMD/SMT; Max Power Dissipation: 125mW; Features: Moisture Resistant,Automotive AEC-Q200; Series: AC; Length: 0.079inch; Width: 0.049inch; Height: 0.024inch; Radiation Hardening: No; Lead Free: Lead Free; RoHS Compliant: Yes; ComponentLink1URL: http://www.mouser.com/ds/2/447/yageodocoutput-1111992.pdf?src-supplier=Mouser; ComponentLink1Description: http://www.mouser.com/ds/2/447/yageodocoutput-1111992.pdf?src-supplier=Mouser; ComponentLink2URL: http://www.yageo.com/documents/recent/PYu-AC_51_RoHS_L_2_revised.pdf?src-supplier=Future+Electronics; ComponentLink2Description: http://www.yageo.com/documents/recent/PYu-AC_51_RoHS_L_2_revised.pdf?src-supplier=Future+Electronics; ComponentLink3URL: http://www.yageo.com/NewPortal/yageodocoutput?fileName=/pdf/R-Chip/PYu-AC_51_RoHS_L_6.pdf&src-supplier=Digi-Key; ComponentLink3Description: http://www.yageo.com/NewPortal/yageodocoutput?fileName=/pdf/R-Chip/PYu-AC_51_RoHS_L_6.pdf&src-supplier=Digi-Key
R4 R9 R15 R16 = RC0805JR-070RL: Surface Mount Thick Film Resistor, RC Series, 125 mW, - 5%, 150 V, 0805 [2012 Metric]; Manufacturer: Yageo; Resistance: 0mR; Power Rating: 125mW; Voltage Rating: 150V; Temperature Coefficient: 200ppm/°C; Supplier 1: Rs; Supplier Part Number 1: 1995753P; Manufacturer Part Number: RC0805JR-070RL; RoHS: Yes; Category: Chip SMD Resistors; Stock 1: 92100; Pricing 1: 1000=0,00700, 2500=0,00700, 5000=0,00600, 10000=0,00600 (GBP); Case/Package: 0805; Number of Pins: 2; Contact Plating: Tin,Matte; Case Code (Imperial): 0805; Case Code (Metric): 2012; Size Code: 0805; Min Operating Temperature: -55°C; Max Operating Temperature: 155°C; Resistor Type: Thick Film; Tolerance: 5%; Packaging: Tape and Reel; Voltage Rating (DC): 150V; Termination: SMD/SMT; Features: Moisture Resistant; Series: RC; Max Power Dissipation: 125mW; Number of Terminations: 2; Construction: Rectangular; Technology: THICK FILM; Resistance Tolerance: 5%; Length: 2mm; Width: 1.25mm; Height: 0.5mm; Depth: 1.25mm; Radiation Hardening: No; RoHS Compliant: Yes; Military Standard: Not; Lead Free: Lead Free; ComponentLink1URL: https://datasheet.ciiva.com/7941/1738694-7941861.pdf?src-supplier=Element14; ComponentLink1Description: https://datasheet.ciiva.com/7941/1738694-7941861.pdf?src-supplier=Element14; ComponentLink2URL: https://datasheet.ciiva.com/11819/0900766b8106beab-11819430.pdf?src-supplier=Rs; ComponentLink2Description: https://datasheet.ciiva.com/11819/0900766b8106beab-11819430.pdf?src-supplier=Rs; ComponentLink3URL: https://datasheet.ciiva.com/7941/1738694-7941862.pdf?src-supplier=Element14; ComponentLink3Description: https://datasheet.ciiva.com/7941/1738694-7941862.pdf?src-supplier=Element14; ComponentLink4URL: https://datasheet.ciiva.com/7941/1738694-7941863.pdf?src-supplier=Element14; ComponentLink4Description: https://datasheet.ciiva.com/7941/1738694-7941863.pdf?src-supplier=Element14; ComponentLink5URL: https://datasheet.ciiva.com/15190/getdatasheetpartid-330685-15190028.pdf?src-supplier=Verical; ComponentLink5Description: https://datasheet.ciiva.com/15190/getdatasheetpartid-330685-15190028.pdf?src-supplier=Verical
R5 R18 R21 R23-R25 = 10K-RT0805BRC0710KL: Res High precision Thin Film 0805 10K Ohm 0.1% 1/8W ±15ppm/°C Molded SMD Paper T/R; Manufacturer: Yageo; Resistance: 10kR; Max Power Dissipation: 125mW; Supplier 1: Digi-Key; Supplier Part Number 1: YAG2186CT-ND; Manufacturer Part Number: RT0805BRC0710KL; RoHS: Yes; Category: Chip SMD Resistors; Stock 1: 5871; Pricing 1: 1=0,73000, 10=0,60700, 100=0,40790, 500=0,29504, 1000=0,23864, 2500=0,23083 (USD); Case/Package: 0805; Case Code (Metric): 2012; Case Code (Imperial): 0805; Min Operating Temperature: -55°C; Max Operating Temperature: 155°C; Tolerance: 0.1%; Packaging: Tape and Reel; Resistor Type: Thin Film; Number of Terminations: 2; Temperature Coefficient: 15ppm/°C; Features: Moisture Resistant; Length: 0.079inch; Width: 0.049inch; Height: 0.024inch; Depth: 1.25mm; Military Standard: Not; Lead Free: Lead Free; RoHS Compliant: Yes; ComponentLink1URL: http://www.yageo.com/documents/recent/PYu-RT_1-to-0.01_RoHS_L_7.pdf?src-supplier=Digi-Key; ComponentLink1Description: http://www.yageo.com/documents/recent/PYu-RT_1-to-0.01_RoHS_L_7.pdf?src-supplier=Digi-Key
R6-R8 R19 R20 R27 R28 = 22ohm_RC0805FR-1322RL: Res Thick Film 0805 22 Ohm 1% 1/8W ±100ppm/°C Molded SMD SMD Paper T/R; Manufacturer: Yageo; Power Rating: 125mW; Voltage Rating: 150V; Supplier 1: Arrow Electronics; Supplier Part Number 1: RC0805FR-1322RL; Manufacturer Part Number: RC0805FR-1322RL; RoHS: Yes; Category: Chip SMD Resistors; Case/Package: 0805; Contact Plating: Tin,Matte; Case Code (Imperial): 0805; Case Code (Metric): 2012; Min Operating Temperature: -55°C; Max Operating Temperature: 155°C; Resistance: 22R; Tolerance: 1%; Resistor Type: Thick Film; Temperature Coefficient: 100ppm/°C; Packaging: Tape and Reel; Termination: SMD/SMT; Series: RC; Construction: Rectangular; Length: 2mm; Width: 1.25mm; Height: 0.5mm; Depth: 1.25mm; Radiation Hardening: No; Military Standard: Not; Lead Free: Lead Free; RoHS Compliant: Yes; ComponentLink1URL: https://datasheet.ciiva.com/12560/rc0805-257173-12560809.pdf?src-supplier=Mouser; ComponentLink1Description: https://datasheet.ciiva.com/12560/rc0805-257173-12560809.pdf?src-supplier=Mouser
R10 R12 R17 = 1K-RC0805FR-071KL: RES SMD 1K OHM 1% 1/8W 0805; Manufacturer: Yageo; Resistance: 1kR; Temperature Coefficient: 100ppm/°C; Voltage Rating (DC): 150V; Power Rating: 125mW; Supplier 1: Farnell; Supplier Part Number 1: 9237496; Manufacturer Part Number: RC0805FR-071KL; RoHS: Yes; Category: Chip SMD Resistors; Stock 1: 198274; Pricing 1: 10=0,02900, 100=0,01200, 500=0,00900, 1000=0,00600, 2500=0,00500 (EUR); Case/Package: 0805; Number of Pins: 2; Case Code (Metric): 2012; Case Code (Imperial): 0805; Size Code: 0805; Min Operating Temperature: -55°C; Max Operating Temperature: 155°C; Tolerance: 1%; Packaging: Tape and Reel; Resistor Type: Thick Film; Package Quantity: 1; Voltage Rating: 150V; Number of Terminations: 2; Termination: SMD/SMT; Max Power Dissipation: 125mW; Features: Moisture Resistant; Series: RC; Resistance Tolerance: 1%; Construction: Rectangular; Length: 0.079inch; Width: 0.049inch; Height: 0.024inch; Depth: 1.25mm; Reach SVHC Compliant: Yes; Lead Free: Lead Free; RoHS Compliant: Yes; Military Standard: Not; ComponentLink1URL: https://datasheet.ciiva.com/7941/1686128-7941719.pdf?src-supplier=Element14; ComponentLink1Description: https://datasheet.ciiva.com/7941/1686128-7941719.pdf?src-supplier=Element14; ComponentLink2URL: https://datasheet.ciiva.com/46385/444164-46385020.pdf?src-supplier=Element14; ComponentLink2Description: https://datasheet.ciiva.com/46385/444164-46385020.pdf?src-supplier=Element14; ComponentLink3URL: https://datasheet.ciiva.com/2456/pyu-r-int-thick-7-2456976.pdf?src-supplier=Digi-Key; ComponentLink3Description: https://datasheet.ciiva.com/2456/pyu-r-int-thick-7-2456976.pdf?src-supplier=Digi-Key; ComponentLink4URL: https://datasheet.ciiva.com/2456/pyu-r-int-thick-7-2456977.pdf?src-supplier=Digi-Key; ComponentLink4Description: https://datasheet.ciiva.com/2456/pyu-r-int-thick-7-2456977.pdf?src-supplier=Digi-Key; ComponentLink5URL: https://datasheet.ciiva.com/2456/pyu-r-int-thick-7-2456975.pdf?src-supplier=Digi-Key; ComponentLink5Description: https://datasheet.ciiva.com/2456/pyu-r-int-thick-7-2456975.pdf?src-supplier=Digi-Key; ComponentLink6URL: https://datasheet.ciiva.com/16850/rc0805-16850409.pdf?src-supplier=Future+Electronics; ComponentLink6Description: https://datasheet.ciiva.com/16850/rc0805-16850409.pdf?src-supplier=Future+Electronics
R11 R22 = 1M-RT0805FRE071ML: High Precision-High Stability Chip Resistor Thin Film 0805 1MOhm 1% Paper T/R; Manufacturer: Yageo; Resistance: 1MR; Power Rating: 125mW; Voltage Rating: 150V; Temperature Coefficient: 50ppm/°C; Supplier 1: Arrow Electronics; Supplier Part Number 1: RT0805FRE071ML; Manufacturer Part Number: RT0805FRE071ML; RoHS: Yes; Category: Chip SMD Resistors; Stock 1: 25000; Pricing 1: 5000=0,00780 (USD); Case/Package: 0805; Number of Pins: 2; Case Code (Metric): 2012; Case Code (Imperial): 0805; Min Operating Temperature: -55°C; Max Operating Temperature: 125°C; Tolerance: 1%; Packaging: Tape and Reel; Package Quantity: 5000; Resistor Type: Thin Film; Number of Terminations: 2; Termination: SMD/SMT; Max Power Dissipation: 125mW; Voltage Rating (DC): 150V; Features: Moisture Resistant; Series: RT; Resistance Tolerance: 1%; Length: 0.079inch; Width: 1.25mm; Height: 0.024inch; RoHS Compliant: Yes; Reach SVHC Compliant: Yes; Lead Free: Lead Free; ComponentLink1URL: https://datasheet.ciiva.com/2561/pyu-rt-1-to-0-05-rohs-l-5-2561041.pdf?src-supplier=Digi-Key; ComponentLink1Description: https://datasheet.ciiva.com/2561/pyu-rt-1-to-0-05-rohs-l-5-2561041.pdf?src-supplier=Digi-Key; ComponentLink2URL: https://datasheet.ciiva.com/5990/1392914-5990581.pdf?src-supplier=Farnell; ComponentLink2Description: https://datasheet.ciiva.com/5990/1392914-5990581.pdf?src-supplier=Farnell; ComponentLink3URL: https://datasheet.ciiva.com/12834/pyu-rt-1-to-0-05-rohs-l-4-12834956.pdf?src-supplier=Mouser; ComponentLink3Description: https://datasheet.ciiva.com/12834/pyu-rt-1-to-0-05-rohs-l-4-12834956.pdf?src-supplier=Mouser; ComponentLink4URL: https://datasheet.ciiva.com/7942/1392914-7942109.pdf?src-supplier=Element14; ComponentLink4Description: https://datasheet.ciiva.com/7942/1392914-7942109.pdf?src-supplier=Element14; ComponentLink5URL: https://datasheet.ciiva.com/7942/1392914-7942110.pdf?src-supplier=Element14; ComponentLink5Description: https://datasheet.ciiva.com/7942/1392914-7942110.pdf?src-supplier=Element14